# Altium schematic sheet STM_ESP.SchDoc
size A4; SheetNumber: 2; SheetTotal: 5
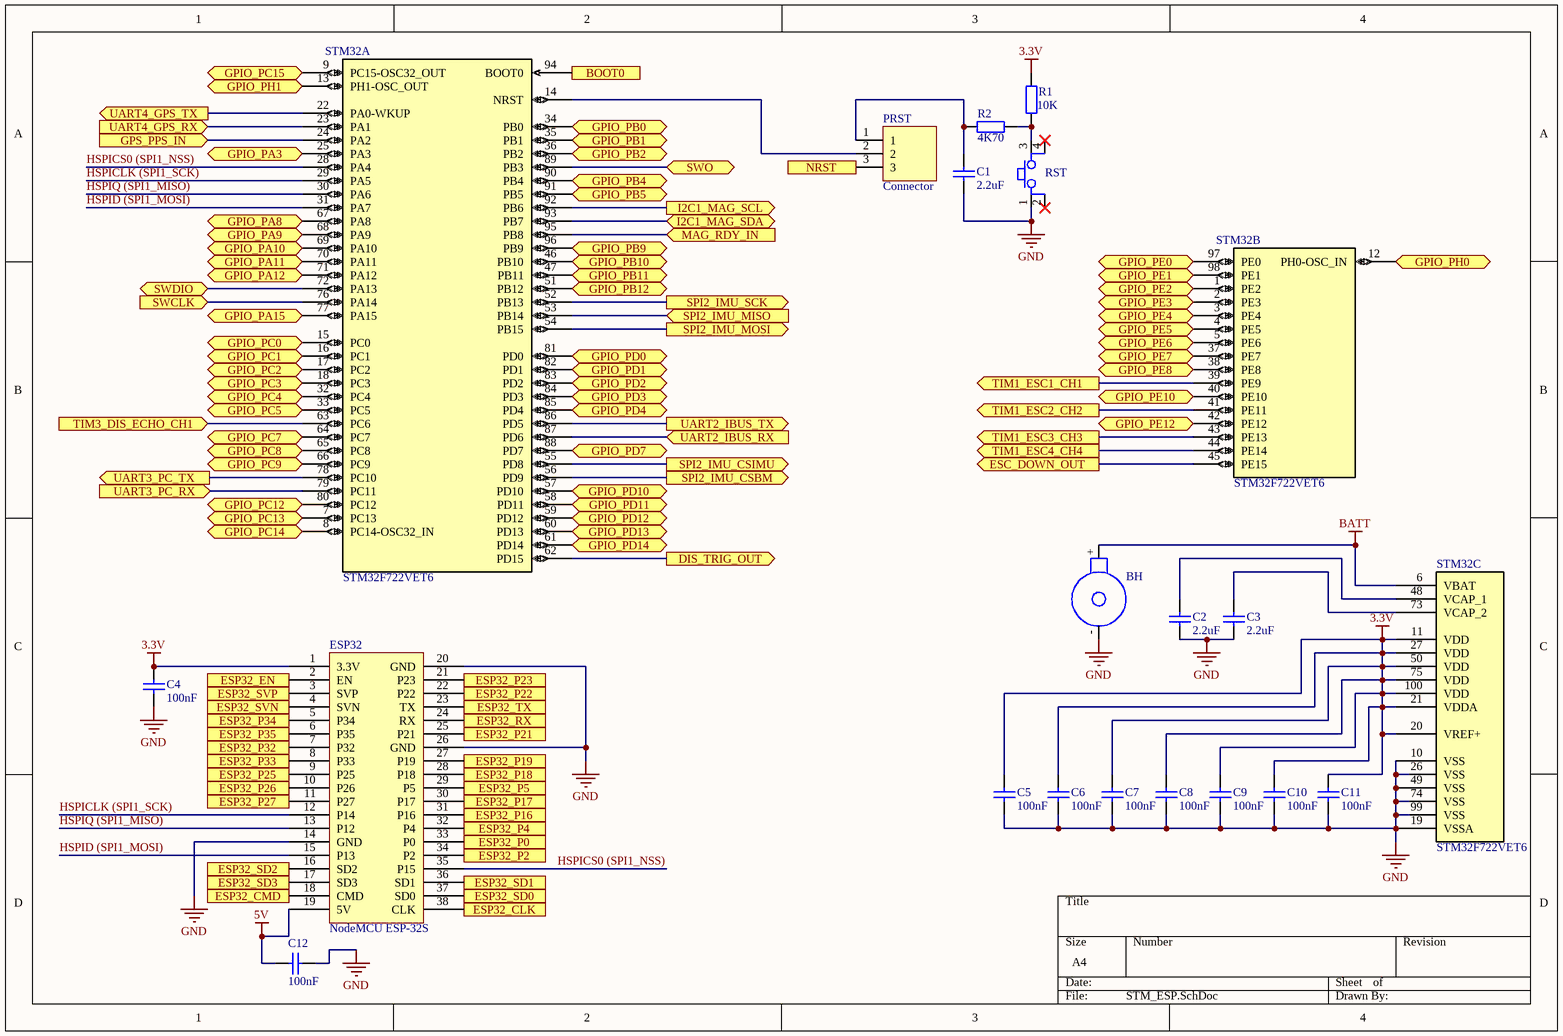
[diagram p0: STM_ESP.SchDoc]

## Parts
BH  Battery Holder  [ONLAB_ELEMTARTO]  (value not drawn)
C1  2.2uF  [FP_0805_CAP_085]
C2  2.2uF  [FP_0805_CAP_085]
C3  2.2uF  [FP_0805_CAP_085]
C4  100nF  [FP_0805_CAP_085]
C5  100nF  [FP_0805_CAP_085]
C6  100nF  [FP_0805_CAP_085]
C7  100nF  [FP_0805_CAP_085]
C8  100nF  [FP_0805_CAP_085]
C9  100nF  [FP_0805_CAP_085]
C10  100nF  [FP_0805_CAP_085]
C11  100nF  [FP_0805_CAP_085]
C12  100nF  [FP_0805_CAP_085]
ESP32  NodeMCU ESP-32S  [ESP32_NODEMCU-32S]
PRST  Connector  [FP_CONN3_TUSKE_254MM]
R1  10K  [FP_0805_RES]
R2  4K70  [FP_0805_RES]
RST  Button  [FP_BTN_SMD]  (value not drawn)
STM32  STM32F722VET6  [LQFP100-14x14mm]  (parts A,B,C of 3)

## Ports
BOOT0 (in), DIS_TRIG_OUT (out), ESC_DOWN_OUT (out), ESP32_CLK, ESP32_CMD, ESP32_EN, ESP32_P0, ESP32_P2, ESP32_P4, ESP32_P5, ESP32_P16, ESP32_P17, ESP32_P18, ESP32_P19, ESP32_P21, ESP32_P22, ESP32_P23, ESP32_P25, ESP32_P26, ESP32_P27, ESP32_P32, ESP32_P33, ESP32_P34, ESP32_P35, ESP32_RX, ESP32_SD0, ESP32_SD1, ESP32_SD2, ESP32_SD3, ESP32_SVN, ESP32_SVP, ESP32_TX, GPIO_PA3 (bidir), GPIO_PA8 (bidir), GPIO_PA9 (bidir), GPIO_PA10 (bidir), GPIO_PA11 (bidir), GPIO_PA12 (bidir), GPIO_PA15 (bidir), GPIO_PB0 (bidir), GPIO_PB1 (bidir), GPIO_PB2 (bidir), GPIO_PB4 (bidir), GPIO_PB5 (bidir), GPIO_PB9 (bidir), GPIO_PB10 (bidir), GPIO_PB11 (bidir), GPIO_PB12 (bidir), GPIO_PC0 (bidir), GPIO_PC1 (bidir), GPIO_PC2 (bidir), GPIO_PC3 (bidir), GPIO_PC4 (bidir), GPIO_PC5 (bidir), GPIO_PC7 (bidir), GPIO_PC8 (bidir), GPIO_PC9 (bidir), GPIO_PC12 (bidir), GPIO_PC13 (bidir), GPIO_PC14 (bidir), GPIO_PC15 (bidir), GPIO_PD0 (bidir), GPIO_PD1 (bidir), GPIO_PD2 (bidir), GPIO_PD3 (bidir), GPIO_PD4 (bidir), GPIO_PD7 (bidir), GPIO_PD10 (bidir), GPIO_PD11 (bidir), GPIO_PD12 (bidir), GPIO_PD13 (bidir), GPIO_PD14 (bidir), GPIO_PE0 (bidir), GPIO_PE1 (bidir), GPIO_PE2 (bidir), GPIO_PE3 (bidir), GPIO_PE4 (bidir), GPIO_PE5 (bidir), GPIO_PE6 (bidir), GPIO_PE7 (bidir), GPIO_PE8 (bidir), GPIO_PE10 (bidir), GPIO_PE12 (bidir), GPIO_PH0 (bidir), GPIO_PH1 (bidir), GPS_PPS_IN (in), I2C1_MAG_SCL (out), I2C1_MAG_SDA (bidir), MAG_RDY_IN (in), NRST (in), SPI2_IMU_CSBM (out), SPI2_IMU_CSIMU (out), SPI2_IMU_MISO (in), SPI2_IMU_MOSI (out), SPI2_IMU_SCK (out), SWCLK (in), SWDIO (bidir), SWO (bidir), TIM1_ESC1_CH1 (out), TIM1_ESC2_CH2 (out), TIM1_ESC3_CH3 (out), TIM1_ESC4_CH4 (out), TIM3_DIS_ECHO_CH1 (in), UART2_IBUS_RX (in), UART2_IBUS_TX (out), UART3_PC_RX (in), UART3_PC_TX (out), UART4_GPS_RX (in), UART4_GPS_TX (out)

## Nets
3.3V: C4.2 C5.1 C6.1 C7.1 C8.1 C9.1 C10.1 C11.1 ESP32.1(3.3V) R1.2 STM32.11(VDD) STM32.20(VREF+) STM32.21(VDDA) STM32.27(VDD) STM32.50(VDD) STM32.75(VDD) STM32.100(VDD)
5V: C12.2 ESP32.19(5V)
BATT: BH.+ STM32.6(VBAT)
GND: BH.- C1.1 C2.1 C3.1 C4.1 C5.2 C6.2 C7.2 C8.2 C9.2 C10.2 C11.2 C12.1 ESP32.14(GND) ESP32.20(GND) ESP32.26(GND) RST.1 STM32.10(VSS) STM32.19(VSSA) STM32.26(VSS) STM32.49(VSS) STM32.74(VSS) STM32.99(VSS)
BOOT0: STM32.94(BOOT0) ; port BOOT0
DIS_TRIG_OUT: STM32.62(PD15) ; port DIS_TRIG_OUT
ESC_DOWN_OUT: STM32.45(PE15) ; port ESC_DOWN_OUT
ESP32_CLK: ESP32.38(CLK) ; port ESP32_CLK
ESP32_CMD: ESP32.18(CMD) ; port ESP32_CMD
ESP32_EN: ESP32.2(EN) ; port ESP32_EN
ESP32_P0: ESP32.33(P0) ; port ESP32_P0
ESP32_P2: ESP32.34(P2) ; port ESP32_P2
ESP32_P4: ESP32.32(P4) ; port ESP32_P4
ESP32_P5: ESP32.29(P5) ; port ESP32_P5
ESP32_P16: ESP32.31(P16) ; port ESP32_P16
ESP32_P17: ESP32.30(P17) ; port ESP32_P17
ESP32_P18: ESP32.28(P18) ; port ESP32_P18
ESP32_P19: ESP32.27(P19) ; port ESP32_P19
ESP32_P21: ESP32.25(P21) ; port ESP32_P21
ESP32_P22: ESP32.22(P22) ; port ESP32_P22
ESP32_P23: ESP32.21(P23) ; port ESP32_P23
ESP32_P25: ESP32.9(P25) ; port ESP32_P25
ESP32_P26: ESP32.10(P26) ; port ESP32_P26
ESP32_P27: ESP32.11(P27) ; port ESP32_P27
ESP32_P32: ESP32.7(P32) ; port ESP32_P32
ESP32_P33: ESP32.8(P33) ; port ESP32_P33
ESP32_P34: ESP32.5(P34) ; port ESP32_P34
ESP32_P35: ESP32.6(P35) ; port ESP32_P35
ESP32_RX: ESP32.24(RX) ; port ESP32_RX
ESP32_SD0: ESP32.37(SD0) ; port ESP32_SD0
ESP32_SD1: ESP32.36(SD1) ; port ESP32_SD1
ESP32_SD2: ESP32.16(SD2) ; port ESP32_SD2
ESP32_SD3: ESP32.17(SD3) ; port ESP32_SD3
ESP32_SVN: ESP32.4(SVN) ; port ESP32_SVN
ESP32_SVP: ESP32.3(SVP) ; port ESP32_SVP
ESP32_TX: ESP32.23(TX) ; port ESP32_TX
GPIO_PA3: STM32.25(PA3) ; port GPIO_PA3
GPIO_PA8: STM32.67(PA8) ; port GPIO_PA8
GPIO_PA9: STM32.68(PA9) ; port GPIO_PA9
GPIO_PA10: STM32.69(PA10) ; port GPIO_PA10
GPIO_PA11: STM32.70(PA11) ; port GPIO_PA11
GPIO_PA12: STM32.71(PA12) ; port GPIO_PA12
GPIO_PA15: STM32.77(PA15) ; port GPIO_PA15
GPIO_PB0: STM32.34(PB0) ; port GPIO_PB0
GPIO_PB1: STM32.35(PB1) ; port GPIO_PB1
GPIO_PB2: STM32.36(PB2) ; port GPIO_PB2
GPIO_PB4: STM32.90(PB4) ; port GPIO_PB4
GPIO_PB5: STM32.91(PB5) ; port GPIO_PB5
GPIO_PB9: STM32.96(PB9) ; port GPIO_PB9
GPIO_PB10: STM32.46(PB10) ; port GPIO_PB10
GPIO_PB11: STM32.47(PB11) ; port GPIO_PB11
GPIO_PB12: STM32.51(PB12) ; port GPIO_PB12
GPIO_PC0: STM32.15(PC0) ; port GPIO_PC0
GPIO_PC1: STM32.16(PC1) ; port GPIO_PC1
GPIO_PC2: STM32.17(PC2) ; port GPIO_PC2
GPIO_PC3: STM32.18(PC3) ; port GPIO_PC3
GPIO_PC4: STM32.32(PC4) ; port GPIO_PC4
GPIO_PC5: STM32.33(PC5) ; port GPIO_PC5
GPIO_PC7: STM32.64(PC7) ; port GPIO_PC7
GPIO_PC8: STM32.65(PC8) ; port GPIO_PC8
GPIO_PC9: STM32.66(PC9) ; port GPIO_PC9
GPIO_PC12: STM32.80(PC12) ; port GPIO_PC12
GPIO_PC13: STM32.7(PC13) ; port GPIO_PC13
GPIO_PC14: STM32.8(PC14-OSC32_IN) ; port GPIO_PC14
GPIO_PC15: STM32.9(PC15-OSC32_OUT) ; port GPIO_PC15
GPIO_PD0: STM32.81(PD0) ; port GPIO_PD0
GPIO_PD1: STM32.82(PD1) ; port GPIO_PD1
GPIO_PD2: STM32.83(PD2) ; port GPIO_PD2
GPIO_PD3: STM32.84(PD3) ; port GPIO_PD3
GPIO_PD4: STM32.85(PD4) ; port GPIO_PD4
GPIO_PD7: STM32.88(PD7) ; port GPIO_PD7
GPIO_PD10: STM32.57(PD10) ; port GPIO_PD10
GPIO_PD11: STM32.58(PD11) ; port GPIO_PD11
GPIO_PD12: STM32.59(PD12) ; port GPIO_PD12
GPIO_PD13: STM32.60(PD13) ; port GPIO_PD13
GPIO_PD14: STM32.61(PD14) ; port GPIO_PD14
GPIO_PE0: STM32.97(PE0) ; port GPIO_PE0
GPIO_PE1: STM32.98(PE1) ; port GPIO_PE1
GPIO_PE2: STM32.1(PE2) ; port GPIO_PE2
GPIO_PE3: STM32.2(PE3) ; port GPIO_PE3
GPIO_PE4: STM32.3(PE4) ; port GPIO_PE4
GPIO_PE5: STM32.4(PE5) ; port GPIO_PE5
GPIO_PE6: STM32.5(PE6) ; port GPIO_PE6
GPIO_PE7: STM32.37(PE7) ; port GPIO_PE7
GPIO_PE8: STM32.38(PE8) ; port GPIO_PE8
GPIO_PE10: STM32.40(PE10) ; port GPIO_PE10
GPIO_PE12: STM32.42(PE12) ; port GPIO_PE12
GPIO_PH0: STM32.12(PH0-OSC_IN) ; port GPIO_PH0
GPIO_PH1: STM32.13(PH1-OSC_OUT) ; port GPIO_PH1
GPS_PPS_IN: STM32.24(PA2) ; port GPS_PPS_IN
HSPICLK (SPI1_SCK): ESP32.12(P14) STM32.29(PA5)
HSPICS0 (SPI1_NSS): ESP32.35(P15) STM32.28(PA4)
HSPID (SPI1_MOSI): ESP32.15(P13) STM32.31(PA7)
HSPIQ (SPI1_MISO): ESP32.13(P12) STM32.30(PA6)
I2C1_MAG_SCL: STM32.92(PB6) ; port I2C1_MAG_SCL
I2C1_MAG_SDA: STM32.93(PB7) ; port I2C1_MAG_SDA
MAG_RDY_IN: STM32.95(PB8) ; port MAG_RDY_IN
NRST: PRST.3 ; port NRST
SPI2_IMU_CSBM: STM32.56(PD9) ; port SPI2_IMU_CSBM
SPI2_IMU_CSIMU: STM32.55(PD8) ; port SPI2_IMU_CSIMU
SPI2_IMU_MISO: STM32.53(PB14) ; port SPI2_IMU_MISO
SPI2_IMU_MOSI: STM32.54(PB15) ; port SPI2_IMU_MOSI
SPI2_IMU_SCK: STM32.52(PB13) ; port SPI2_IMU_SCK
SWCLK: STM32.76(PA14) ; port SWCLK
SWDIO: STM32.72(PA13) ; port SWDIO
SWO: STM32.89(PB3) ; port SWO
TIM1_ESC1_CH1: STM32.39(PE9) ; port TIM1_ESC1_CH1
TIM1_ESC2_CH2: STM32.41(PE11) ; port TIM1_ESC2_CH2
TIM1_ESC3_CH3: STM32.43(PE13) ; port TIM1_ESC3_CH3
TIM1_ESC4_CH4: STM32.44(PE14) ; port TIM1_ESC4_CH4
TIM3_DIS_ECHO_CH1: STM32.63(PC6) ; port TIM3_DIS_ECHO_CH1
UART2_IBUS_RX: STM32.87(PD6) ; port UART2_IBUS_RX
UART2_IBUS_TX: STM32.86(PD5) ; port UART2_IBUS_TX
UART3_PC_RX: STM32.79(PC11) ; port UART3_PC_RX
UART3_PC_TX: STM32.78(PC10) ; port UART3_PC_TX
UART4_GPS_RX: STM32.23(PA1) ; port UART4_GPS_RX
UART4_GPS_TX: STM32.22(PA0-WKUP) ; port UART4_GPS_TX
NetC1_2: C1.2 PRST.1 R2.1
NetC2_2: C2.2 STM32.48(VCAP_1)
NetC3_2: C3.2 STM32.73(VCAP_2)
NetPRST_2: PRST.2 STM32.14(NRST)
NetR1_1: R1.1 R2.2 RST.3

Not connected (* = marked no-connect by the designer): RST 2* 4*

## Library data of the parts
BH = Battery Holder: ELEMTARTÓ 1x2032 BH2032-3P (T-T) NYÁK FEKVŐ /CR2032/
C1-C12 = CAP: Capacitor
  C1-C3: Value: 2.2uF
  C4-C12: Value: 100nF
ESP32 = NodeMCU ESP-32S: NodeMCU ESP32 Wireless & / Bluetooth Development Board
PRST = Connector_3pin: 3pin connector
R1 R2 = RES: Resistor
  R1: Value: 10K
  R2: Value: 4K70
RST = Button 4P: Push button
STM32 = STM32F722VET6: No Description Available; Mfr_Name: STMicroelectronics; RefDes: RefDes; Type: Type